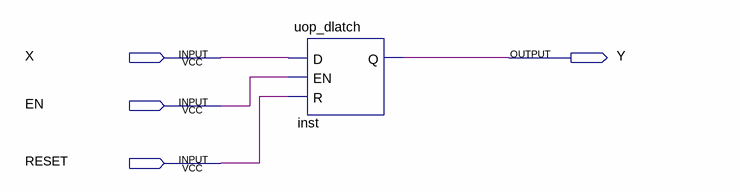
[diagram p0: schematic sheet]
// Quartus schematic behavioural.bdf as structural Verilog: 1 symbols, 4 pins
module behavioural (
  input  X,
  input  EN,
  input  RESET,
  output Y
);

  uop_dlatch inst (.D(X), .EN(EN), .R(RESET), .Q(Y));
endmodule
